# Altium project uz_per_ktr_torque_box.PrjPCB
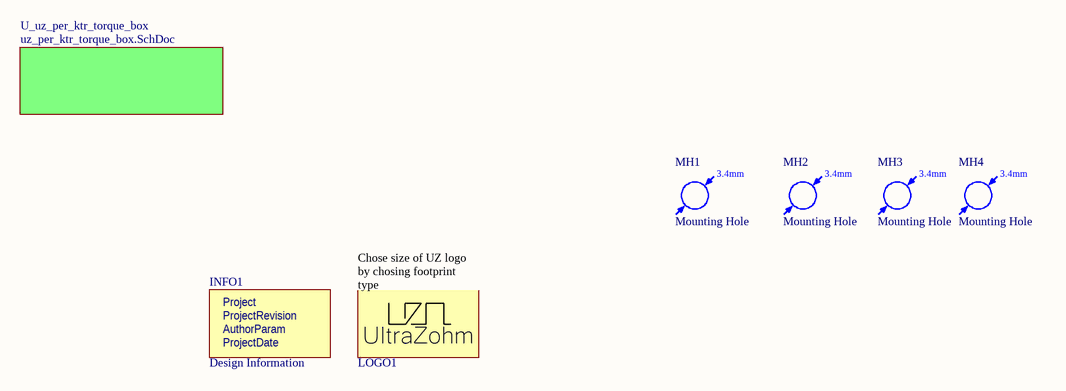
[diagram p0: TopSheet.SchDoc]
ProjectDate: 06/25; AuthorParam: F. Rosner; ProjectRevision: Rev01; Project: uz_per_ktr_torque_box
2 sheets, 28 parts. Net scope: global (net labels, ports and power ports of the same name join across sheets).
Board file: uz_per_ktr_torque_box.PcbDoc
Sheets:
  TopSheet.SchDoc
    U_uz_per_ktr_torque_box = uz_per_ktr_torque_box.SchDoc

## Sheet TopSheet.SchDoc
size A4

### Parts
INFO1  Design Information  [Design_info]  (no BOM)
LOGO1  UZ Logo  [UZ_Logo_small]  (value not drawn)  (no BOM)
MH1  Mounting Hole  [MH_3.4]  (no BOM)
MH2  Mounting Hole  [MH_3.4]  (no BOM)
MH3  Mounting Hole  [MH_3.4]  (no BOM)
MH4  Mounting Hole  [MH_3.4]  (no BOM)

### Sub-sheets
U_uz_per_ktr_torque_box = uz_per_ktr_torque_box.SchDoc: no entries

### Notes on the sheet
- (near LOGO1) Chose size of UZ logo by chosing footprint type
- (in symbol Design Information) Project; ProjectRevision; AuthorParam; ProjectDate
- (in symbol Mounting Hole) 3.4mm

### Library data of the parts
INFO1 = Design Information: Manufacturer: UltraZohm; Created from: MGremer; Manufacturer Part Number: Design Information; PartID: 12; Created On: 03.11.2021 09:04:23; ComponentLink1Description: https://docs.ultrazohm.com/; ComponentLink1URL: homepage; Component Type: Design Information; Last Updated: 15.04.2025 09:29:36; Supplier 1: -; Supplier Part Number 1: -; Type: Design Information; Value: Design Information; Live Cycle Status: 1
LOGO1 = 1: Official Project Logo of the UltraZohm; Manufacturer: PCB Manufacturer; Manufacturer Part Number: UltraZohm Logo; Created from: T. Wendt; PartID: 1; Created On: 19.02.2021 16:55:56; ComponentLink1Description: Homepage; ComponentLink1URL: https://ultrazohm.com; Component Type: Logo; Last Updated: 02.03.2021 14:31:24; Type: Standard (No BOM); Live Cycle Status: 1
MH1-MH4 = Mounting Hole: Created from: MHlatky; Manufacturer Part Number: Mounting Hole; PartID: 16; Created On: 26.01.2021 09:19:51; ComponentLink1Description: Datasheet; Component Type: Mounting Hole; Device Package: -; Last Updated: 21.03.2022 23:05:12; Manufacturer: Mounting Hole; Supplier 1: Mounting Hole; Supplier Part Number 1: Mounting Hole; Type: Mounting Hole; Value: Mounting Hole; Live Cycle Status: 1; Stock number: not stored

## Sheet uz_per_ktr_torque_box.SchDoc
size A4; Author: F. Rosner; CompanyName: Technische Hochschule Nürnberg Georg Simon Ohm; Organization: UltraZohm; Address1: Kesslerplatz 12; Address2: 90489 Nürnberg; Address3: GERMANY; DocumentNumber: 1; SheetNumber: 1; SheetTotal: 2; Website: www.ultrazohm.com
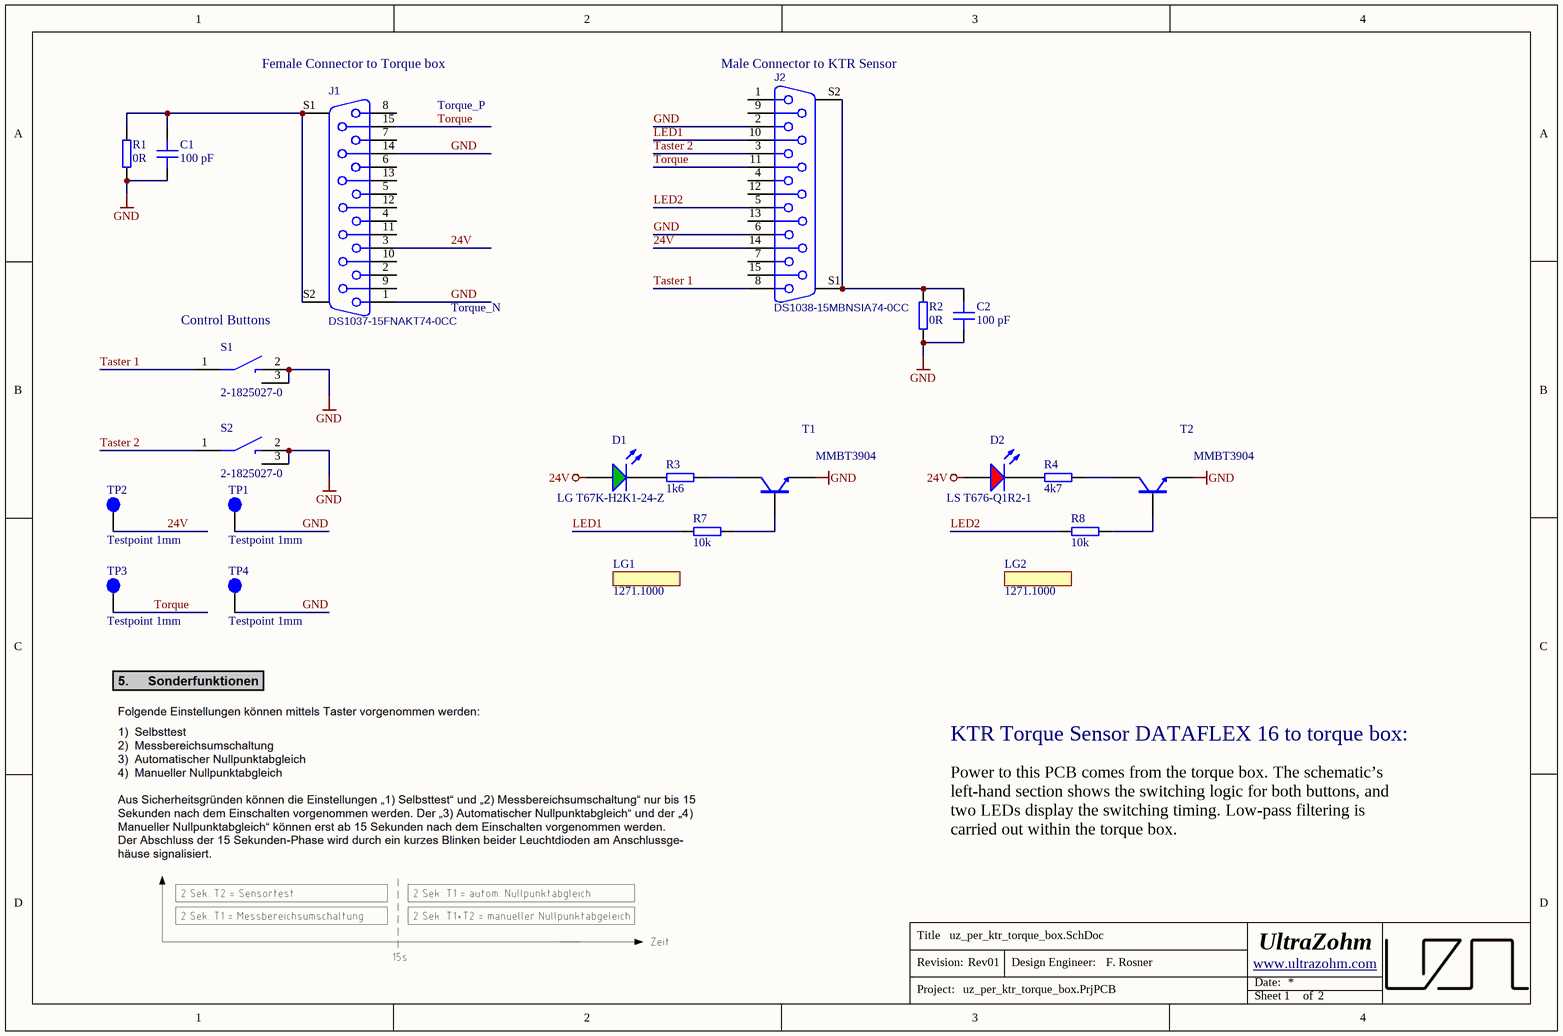
[diagram p1: uz_per_ktr_torque_box.SchDoc]

### Parts
C1  100 pF  [C_1206]
C2  100 pF  [C_1206]
D1  LG T67K-H2K1-24-Z  [FP-LS_T676-Q1R2-1-Z-MFG]
D2  LS T676-Q1R2-1  [FP-LS_T676-Q1R2-1-Z-MFG]
J1  DS1037-15FNAKT74-0CC  [PCB - MISC - DSUB15]
J2  DS1038-15MBNSIA74-0CC  [DSUB15-3]
LG1  1271.1000  [1271.1000]
LG2  1271.1000  [1271.1000]
R1  0R  [RES 1206_3216]
R2  0R  [RES 1206_3216]
R3  1k6  [R_1206_TE]
R4  4k7  [R_1206_TE]
R7  10k  [R_0603_TE]
R8  10k  [R_0603_TE]
S1  2-1825027-0  [2-1825027-0]
S2  2-1825027-0  [2-1825027-0]
T1  MMBT3904  [SOT95P280X145-3N]
T2  MMBT3904  [SOT95P280X145-3N]
TP1  Testpoint 1mm  [TP_1mm]  (no BOM)
TP2  Testpoint 1mm  [TP_1mm]  (no BOM)
TP3  Testpoint 1mm  [TP_1mm]  (no BOM)
TP4  Testpoint 1mm  [TP_1mm]  (no BOM)

### Nets
24V: D1.2(A) D2.2(A) J1.3 J2.14 TP2.1
GND: C1.1 C2.1 J1.1 J1.14 J2.2 J2.6 R1.1 R2.1 S1.2(NO) S1.3(GND) S2.2(NO) S2.3(GND) T1.2(EMITTER) T2.2(EMITTER) TP1.1 TP4.1
LED1: J2.10 R7.1
LED2: J2.5 R8.1
Taster 1: J2.8 S1.1(COM1)
Taster 2: J2.3 S2.1(COM1)
Torque: J1.15 J2.11 TP3.1
NetC1_2: C1.2 J1.S1(MH1) J1.S2(MH2) R1.2
NetC2_2: C2.2 J2.S1(MH1) J2.S2(MH2) R2.2
NetD1_1: D1.1(K) R3.1
NetD2_1: D2.1(K) R4.1
NetR3_2: R3.2 T1.3(COLLECTOR)
NetR4_2: R4.2 T2.3(COLLECTOR)
NetR7_2: R7.2 T1.1(BASIS)
NetR8_2: R8.2 T2.1(BASIS)

Not connected (* = marked no-connect by the designer): J1 2 4 5 6 7 8 9 10 11 12 13; J2 1 4 7 9 12 13 15

### Notes on the sheet
- (near J1) Female Connector to Torque box
- Torque_P
- (near J2) Male Connector to KTR Sensor
- Torque_N
- Control Buttons
- KTR Torque Sensor DATAFLEX 16 to torque box:
- Power to this PCB comes from the torque box. The schematic’s left-hand section shows the switching logic for both buttons, and two LEDs display the switching timing. Low-pass filtering is carried out within the torque box.
- Title
- Revision:
- Design Engineer:
- Date:
- Project:
- Sheet
- of

### Library data of the parts
C1 C2 = 885342008009: Capacitor 1206, 1 kVDC, 100 pF, C0G; Manufacturer: Wuerth Elektronik; Tolerance: 5 %; Voltage Rating: 1 kVDC; Created from: MGremer; Manufacturer Part Number: 885342008009; PartID: 62; Created On: 20.12.2020 13:54:13; ComponentLink1Description: Datasheet; ComponentLink1URL: https://www.mouser.de/datasheet/2/445/885342008009-1727900.pdf; Component Type: Capacitor 1206; Device Package: 1206; Last Updated: 20.12.2020 17:44:37; Mounting Type: SMD; Operating Temperature: -55 - 125°C; Series: WCAP-CSMH; Supplier 1: Mouser; Supplier Part Number 1: 710-885342008009; Type: Capacitor; Value: 100 pF; Live Cycle Status: 1; Stock number: Labor SMD Container
D1 = LG T67K-H2K1-24-Z: Standard LEDs - SMD Green, 570nm 9mcd, 2mA; Manufacturer: OSRAM Opto Semicon; Created from: FRosner; Forward Current I_f: 20 mA; Forward Voltage U_f: 2.2V; Light Intensity: 6.28 mcd; Nominal Power: 44mW; Manufacturer Part Number: LG T67K-H2K1-24-Z; PartID: 17; Created On: 17/07/2024 13:28:00; ComponentLink1Description: Datasheet; ComponentLink1URL: https://dammedia.osram.info/media/resource/hires/osram-dam-5522864/LG%20T67K_EN.pdf; Component Type: LED Diode; Device Package: PLCC-2; Last Updated: 17/07/2024 14:01:05; Mounting Type: SMD; Operating Temperature: -40 - 100 °C; Supplier 1: LCSC; Supplier Part Number 1: C5248446; Type: Standard; Live Cycle Status: 1; Stock number: not stored; Color: green; Wavelength: 570 nm; LCSC Part Number: C5248446
D2 = LS T676-Q1R2-1: Standard LEDs - SMD Super Red, 645nm 180mcd, 20mA; Manufacturer: OSRAM Opto Semicon; Created from: FRosner; Forward Voltage U_f: 2.3V; Wavelength: 633 nm; Light Intensity: 71 ... 180 mcd; Nominal Power: 46mW; Manufacturer Part Number: LS T676-Q1R2-1; PartID: 16; Created On: 17/07/2024 13:16:06; ComponentLink1Description: Datasheet; ComponentLink1URL: https://wmsc.lcsc.com/wmsc/upload/file/pdf/v2/lcsc/2312251447_OSRAM-Opto-Semicon-LS-T676-Q1R2-1_C19360690.pdf; Component Type: LED Diode; Device Package: PLCC-2; Last Updated: 17/07/2024 13:21:16; Mounting Type: SMD; Operating Temperature: -40 - 100 °C; Supplier 1: LCSC; Supplier Part Number 1: C19360690; Type: Standard; Live Cycle Status: 1; Stock number: not stored; Color: red; Forward Current I_f: 20 mA; LCSC Part Number: C19360690
J1 = DS1037-15FNAKT74-0CC: 15 Female D-Sub Shrouded 2 3A -40℃~+85℃ Plugin D-Sub/DVI/HDMI Connectors ROHS; BOM_Manufacturer: Nextron(台湾正凌); Manufacturer: CONNFLY Elec; Contributor: LCSC; Created from: FRosner; BOM_Supplier: LCSC; BOM_Supplier Part: C2846090; BOM_Manufacturer Part: SUB-DRBF-607A-002; BOM_JLCPCB Part Class: Extended Part; spicePre: D; spiceSymbolName: SUB-DRBF-607A-002; Manufacturer Part Number: DS1037-15FNAKT74-0CC; PartID: 10; Created On: 17.03.2023 15:40:49; ComponentLink1Description: Datasheet; ComponentLink1URL: https://jlcpcb.com/partdetail/ConnflyElec-DS1037_15FNAKT740CC/C77835; Component Type: DSUB 15 pole female; Device Package: THT; Last Updated: 04.05.2023 15:17:49; Mounting Type: THT; Operating Temperature: -40℃+105℃; Supplier 1: LCSC; Supplier Part Number 1: C77835; Type: DSUB 15 pole; Live Cycle Status: 1; LCSC Part Number: C77835; Stock number: not stored
J2 = DS1038-15MBNSIA74-0CC: 15P Male D-Sub Bend insert 3 1.5A -40℃~+105℃ Push-Pull D-Sub / VGA Connectors ROHS; BOM_Manufacturer: Nextron(台湾正凌); Manufacturer: CONNFLY Elec; Contributor: LCSC; Created from: FRosner; BOM_Supplier: LCSC; BOM_Supplier Part: C2846090; BOM_Manufacturer Part: SUB-DRBF-607A-002; BOM_JLCPCB Part Class: Extended Part; spicePre: D; spiceSymbolName: SUB-DRBF-607A-002; Manufacturer Part Number: DS1038-15MBNSIA74-0CC; PartID: 12; Created On: 26.05.2025 08:45:47; ComponentLink1Description: Datasheet; ComponentLink1URL: https://jlcpcb.com/partdetail/ConnflyElec-DS1038_15MBNSIA740CC/C77842; Component Type: DSUB 15 pole male; Device Package: THT; Last Updated: 26.05.2025 08:45:47; Mounting Type: THT; Operating Temperature: -40℃+105℃; Supplier 1: LCSC; Supplier Part Number 1: C77842; Type: DSUB 15 pole; Live Cycle Status: 1; LCSC Part Number: C77842; Stock number: not stored
LG1 LG2 = 1271.1000: Light guide, horizontal, 18.29 mm, 1 rod, round, PCB mounting, transparent; Manufacturer: MENTOR; Created from: FRosner; Value: 1271.1000; Manufacturer Part Number: 1271.1000; PartID: 39; Created On: 15.07.2024 08:35:38; ComponentLink1Description: Datasheet; ComponentLink1URL: https://www.farnell.com/datasheets/1693501.pdf; Component Type: Light Guide; Device Package: SMD; Last Updated: 15.07.2024 08:35:38; Mounting Type: SMD; Operating Temperature: -40°C - +85°C; Supplier 1: Farnell; Supplier Part Number 1: 2300553; Supplier 2: LCSC; Supplier Part Number 2: C22441102; Type: Lightguide; Live Cycle Status: 1; LCSC Part Number: C22441102; Stock number: not stored
R1 R2 = 1206W4F0000T5E: 250mW Thick Film Resistors ±800ppm/℃ ±1% 0Ω 1206 Chip Resistor - Surface Mount ROHS; Manufacturer: UNI-ROYAL; Created from: AGeiger; Manufacturer Part Number: 1206W4F0000T5E; PartID: 271; Created On: 06.06.2023 20:12:49; ComponentLink1Description: Datasheet; ComponentLink1URL: https://datasheet.lcsc.com/lcsc/2206010200_UNI-ROYAL-Uniroyal-Elec-1206W4F0000T5E_C17888.pdf; Component Type: SMD resistor; Device Package: 1206; Last Updated: 06.06.2023 20:12:49; Mounting Type: SMD; Supplier 1: LCSC; Supplier Part Number 1: C17888; Type: Resistor; Tolerance: 1%; Value: 0R; Live Cycle Status: 1; LCSC Part Number: C17888
R3 = UZgen_R_1206_1k6: Generic resistor; Manufacturer: UZgen; Tolerance: 1 %; Created from: UZgenTool; Manufacturer Part Number: UZgen_R_1206_1k6; PartID: 513; Created On: 02/07/2024 17:29:56; Device Package: 1206; Last Updated: 02/07/2024 17:29:56; Mounting Type: SMD; Value: 1k6; LCSC Part Number: C17896
R4 = UZgen_R_1206_4k7: Generic resistor; Manufacturer: UZgen; Tolerance: 1 %; Created from: UZgenTool; Manufacturer Part Number: UZgen_R_1206_4k7; PartID: 524; Created On: 02/07/2024 17:29:56; Device Package: 1206; Last Updated: 02/07/2024 17:29:56; Mounting Type: SMD; Value: 4k7; LCSC Part Number: C17936
R7 R8 = UZgen_R_0603_10k: Generic resistor; Manufacturer: UZgen; Tolerance: 1 %; Created from: AGeiger; Value: 10k; Manufacturer Part Number: UZgen_R_0603_10k; PartID: 1; Created On: 02/07/2024 14:34:53; Device Package: 0603; Mounting Type: SMD; Last Updated: 02/07/2024 14:37:16; LCSC Part Number: C15401
S1 S2 = 2-1825027-0: Round Button 50mA Direct Insert SPST - normally open 160gf 24V Plugin Tactile Switches ROHS; Manufacturer: TE Connectivity; Created from: FRosner; Manufacturer Part Number: 2-1825027-0; PartID: 60; Created On: 18.06.2025 09:18:18; ComponentLink1Description: Datasheet; ComponentLink1URL: https://jlcpcb.com/api/file/downloadByFileSystemAccessId/8590147071803228160; Component Type: Round Button; Device Package: THT; Last Updated: 18.06.2025 09:18:18; Mounting Type: THT; Operating Temperature: -20 to +105 °C; Supplier 1: LCSC; Supplier Part Number 1: C590206; Type: Button; Live Cycle Status: 1; LCSC Part Number: C590206
T1 T2 = MMBT3904: Bipolartransistor, 40V 200mW 200mA 100@10mA,1V 300MHz 300mV@50mA,5mA NPN +150℃@(Tj) SOT-23(SOT-23-3); Manufacturer: Jiangsu Changjing Electronics Technology Co., Ltd.; Number Of Channels: single; Collector Basis Voltage: 60 V; Created from: NDiringer; Manufacturer Part Number: MMBT3904; PartID: 2; Created On: 10/06/2022 12:04:49; ComponentLink1Description: Datasheet; ComponentLink1URL: https://datasheet.lcsc.com/lcsc/1811011934_Jiangsu-Changjing-Electronics-Technology-Co---Ltd--MMBT3904_C20526.pdf; Component Type: Bipolartransistor; Device Package: SOT-23-3; Last Updated: 10/08/2022 13:48:16; Mounting Type: SMD; Operating Temperature: -55 - 150 °C; Series: MMBT3904; Supplier 1: Mouser; Supplier Part Number 1: MMBT3904; Supplier 2: LCSC/JLCPCB; Supplier Part Number 2: C20526; Type: Bipolartransistor; Collector Emitter Voltage: 40 V; Polarization: NPN; Power Dissipation: 200 mW; Value: 40 V; Live Cycle Status: 1; LCSC Part Number: C20526
TP1-TP4 = NULL: Manufacturer Part Number: NULL; Created from: AGeiger; Created: 2018_06_25_AGeiger; Value: Testpoint 1mm; PartID: 9; Created On: 20.09.2022 13:14:57; Component Type: Testpoint; Last Updated: 20.09.2022 13:15:39; Manufacturer: NULL; Supplier 1: NULL; Supplier Part Number 1: NULL; Type: Testpoint; Live Cycle Status: 1

## Assembly variants
Default: not fitted C1 C2